# EAGLE schematic Sensor_IMU_MPU-6050_I2C_0b1101000 (EAGLE 6.5.0)
Inertial Measurement Unit via I2C MPU-6050 <http://www.invensense.com/mems/gyro/documents/PS-MPU-6000A.pdf> Connect IMU_SCL_x to the SCL pin on the microcontroller Connect IMU_SDA_x to the SDA pin on the microcontroller Connect IMU_IRQ_x to an interruptable pin on the microcontroller This block includes all supply bypass capacitors.
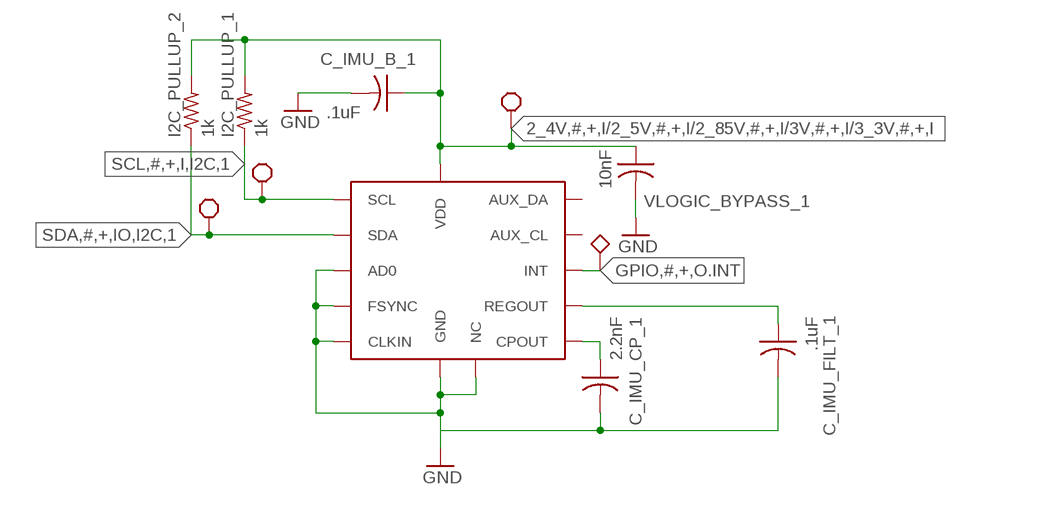
[diagram p0: schematic, sheet 1]

## Parts
C_IMU_B_1  .1uF  C-USC0603  [C0603]
C_IMU_CP_1  2.2nF  C-USC0603  [C0603]
C_IMU_FILT_1  .1uF  C-USC0603  [C0603]
I2C_PULLUP_1  1k  R-US_R0603  [R0603]
I2C_PULLUP_2  1k  R-US_R0603  [R0603]
U$1  MPU-6050  [QFN24-4X4-EXPOSED_PAD_KEEPOUT]
VLOGIC_BYPASS_1  10nF  C-USC0603  [C0603]

## Nets
2_4V,#,+,I/2_5V,#,+,I/2_85V,#,+,I/3V,#,+,I/3_3V,#,+,I: C_IMU_B_1.1 I2C_PULLUP_1.2 I2C_PULLUP_2.2 U$1.P$8(VDD) U$1.P$13(VDD) VLOGIC_BYPASS_1.1 ; supply symbol labelled BLOCK_REQUIREMENT
CPOUT_1: C_IMU_CP_1.1
GND: C_IMU_B_1.2 C_IMU_CP_1.2 C_IMU_FILT_1.2 U$1.P$1(CLKIN) U$1.P$2(NC) U$1.P$3(NC) U$1.P$4(NC) U$1.P$5(NC) U$1.P$9(AD0) U$1.P$11(FSYNC) U$1.P$14(NC) U$1.P$15(NC) U$1.P$16(NC) U$1.P$17(NC) U$1.P$18(GND) VLOGIC_BYPASS_1.2
GPIO,#,+,O.INT: U$1.P$12(INT) ; supply symbol labelled BLOCK_RECOMMENDED
N$5: U$1.P$20(CPOUT)
REGOUT_1: C_IMU_FILT_1.1 U$1.P$10(REGOUT)
SCL,#,+,I,I2C,1: I2C_PULLUP_1.1 U$1.P$23(SCL) ; supply symbol labelled BLOCK_REQUIREMENT
SDA,#,+,IO,I2C,1: I2C_PULLUP_2.1 U$1.P$24(SDA) ; supply symbol labelled BLOCK_REQUIREMENT
Unconnected: U$1.P$6(AUX_DA) U$1.P$7(AUX_CL)

## Library data of the parts
C_IMU_B_1 C_IMU_CP_1 C_IMU_FILT_1 VLOGIC_BYPASS_1 = resistor:C-US: CAPACITOR, American symbol
I2C_PULLUP_1 I2C_PULLUP_2 = resistor:R-US_: RESISTOR, American symbol
U$1 = block_parts:MPU-6050: Invensense MPU series Accelerometer Gyroscope Magnetometer MPU-6050 QFN24-4x4 <http://www.invensense.com/mems/gyro/documents/PS-MPU-6000A-00v3.4.pdf>

## Net classes
0 default: width 0.178 mm, drill 0.381 mm, clearance 0.178 mm